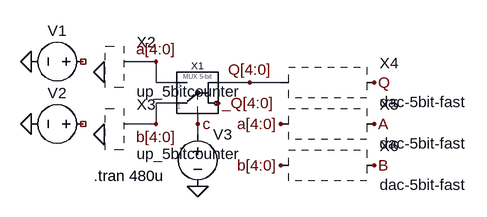
[diagram p0: schematic test-mux-5bit-2to1.asc]
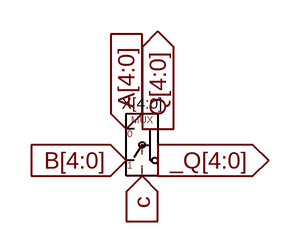
[diagram p1: sub-circuit mux-5bit-2to1.asc]
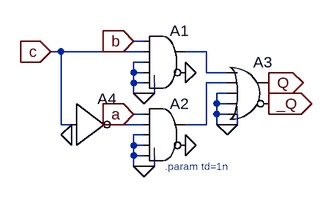
[diagram p2: sub-circuit mux-1bit-2to1.asc]
test-mux-5bit-2to1.asc, the LTspice schematic file:
Version 4
SHEET 1 880 680
WIRE 80 80 32 80
WIRE 80 112 80 80
WIRE 112 112 80 112
WIRE 224 112 176 112
WIRE 272 112 224 112
WIRE 112 144 80 144
WIRE 80 176 80 144
WIRE 80 176 32 176
WIRE 144 176 144 160
WIRE 144 192 144 176
FLAG -112 80 0
FLAG -112 176 0
FLAG 80 80 a[4:0]
FLAG 80 176 b[4:0]
FLAG 144 272 0
FLAG 144 176 c
FLAG 224 112 Q[4:0]
FLAG 176 144 _Q[4:0]
FLAG 0 96 0
FLAG 0 192 0
FLAG 416 112 Q
FLAG 416 176 A
FLAG 416 240 B
FLAG 272 176 a[4:0]
FLAG 272 240 b[4:0]
SYMBOL voltage -16 80 R90
WINDOW 0 -32 56 VBottom 2
WINDOW 3 32 56 Invisible 2
WINDOW 123 0 0 Left 0
WINDOW 39 0 0 Left 0
SYMATTR InstName V1
SYMATTR Value PULSE(0 1 1u 1n 1n 1u 2u)
SYMBOL voltage -16 176 R90
WINDOW 0 -32 56 VBottom 2
WINDOW 3 32 56 Invisible 2
WINDOW 123 0 0 Left 0
WINDOW 39 0 0 Left 0
SYMATTR InstName V2
SYMATTR Value PULSE(0 1 3u 1n 1n 3u 6u)
SYMBOL voltage 144 176 R0
WINDOW 3 24 96 Invisible 2
WINDOW 123 0 0 Left 0
WINDOW 39 0 0 Left 0
SYMATTR Value PULSE(0 1 240u 1n 1n 240u 480u)
SYMATTR InstName V3
SYMBOL dac-5bit-fast 336 112 R0
SYMATTR InstName X4
SYMBOL dac-5bit-fast 336 176 R0
SYMATTR InstName X5
SYMBOL dac-5bit-fast 336 240 R0
SYMATTR InstName X6
SYMBOL mux-5bit-2to1 144 128 R0
SYMATTR InstName X1
SYMBOL up_5bitcounter 0 80 R0
SYMATTR InstName X2
SYMBOL up_5bitcounter 0 176 R0
SYMATTR InstName X3
TEXT -16 256 Left 2 !.tran 480u

mux-5bit-2to1.asc, the sub-circuit schematic file:
Version 4
SHEET 1 880 680
FLAG 160 192 A[4:0]
IOPIN 160 192 In
FLAG 160 224 B[4:0]
IOPIN 160 224 In
FLAG 192 192 Q[4:0]
IOPIN 192 192 Out
FLAG 192 224 _Q[4:0]
IOPIN 192 224 Out
FLAG 176 240 c
IOPIN 176 240 In
SYMBOL mux-1bit-2to1 176 208 R0
SYMATTR InstName X[4:0]

mux-1bit-2to1.asc, the sub-circuit schematic file:
Version 4
SHEET 1 880 680
WIRE 144 64 128 64
WIRE 16 80 0 80
WIRE 144 80 16 80
WIRE 240 80 208 80
WIRE 144 96 128 96
WIRE 128 112 128 96
WIRE 144 112 128 112
WIRE 240 112 240 80
WIRE 272 112 240 112
WIRE 128 128 128 112
WIRE 144 128 128 128
WIRE 272 128 240 128
WIRE 128 144 128 128
WIRE 144 144 128 144
WIRE 160 144 160 128
WIRE 160 144 144 144
WIRE 272 144 256 144
WIRE 256 160 256 144
WIRE 272 160 256 160
WIRE 144 176 128 176
WIRE 256 176 256 160
WIRE 272 176 256 176
WIRE 16 192 16 80
WIRE 32 192 16 192
WIRE 144 192 96 192
WIRE 240 192 240 128
WIRE 240 192 208 192
WIRE 256 192 256 176
WIRE 272 192 256 192
WIRE 288 192 288 176
WIRE 288 192 272 192
WIRE 144 208 128 208
WIRE 128 224 128 208
WIRE 144 224 128 224
WIRE 128 240 128 224
WIRE 144 240 128 240
WIRE 128 256 128 240
WIRE 144 256 128 256
WIRE 160 256 160 240
WIRE 160 256 144 256
FLAG 144 144 0
FLAG 208 112 0
FLAG 128 64 b
IOPIN 128 64 In
FLAG 0 80 c
IOPIN 0 80 In
FLAG 144 256 0
FLAG 208 224 0
FLAG 128 176 a
IOPIN 128 176 In
FLAG 272 192 0
FLAG 336 160 _Q
IOPIN 336 160 Out
FLAG 336 128 Q
IOPIN 336 128 Out
FLAG 32 208 0
SYMBOL Digital\\and 176 32 R0
SYMATTR InstName A1
SYMBOL Digital\\or 304 80 R0
SYMATTR InstName A3
SYMBOL Digital\\inv 32 128 R0
SYMATTR InstName A4
SYMBOL Digital\\and 176 144 R0
SYMATTR InstName A2
TEXT 176 256 Left 1 ;.param td=1n

The netlist it stands for:
* test-mux-5bit-2to1.asc
V1 NC_01 0 PULSE(0 1 1u 1n 1n 1u 2u)
V2 NC_02 0 PULSE(0 1 3u 1n 1n 3u 6u)
V3 c 0 PULSE(0 1 240u 1n 1n 240u 480u)
* X4: dac-5bit-fast (symbol dac-5bit-fast not available, pin order unknown); nets seen at it: Q, Q[4:0]
* X5: dac-5bit-fast (symbol dac-5bit-fast not available, pin order unknown); nets seen at it: A, a[4:0]
* X6: dac-5bit-fast (symbol dac-5bit-fast not available, pin order unknown); nets seen at it: B, b[4:0]
XX1 a[4] a[3] a[2] a[1] a[0] b[4] b[3] b[2] b[1] b[0] c _Q[4] _Q[3] _Q[2] _Q[1] _Q[0] Q[4] Q[3] Q[2] Q[1] Q[0] mux-5bit-2to1
* X2: up_5bitcounter (symbol up_5bitcounter not available, pin order unknown); nets seen at it: 0, a[4:0]
* X3: up_5bitcounter (symbol up_5bitcounter not available, pin order unknown); nets seen at it: 0, b[4:0]

* block symbol definitions
.subckt mux-5bit-2to1 A[4] A[3] A[2] A[1] A[0] B[4] B[3] B[2] B[1] B[0] c _Q[4] _Q[3] _Q[2] _Q[1] _Q[0] Q[4] Q[3] Q[2] Q[1] Q[0]
XX[4:0] A[4:0] B[4:0] c _Q[4:0] Q[4:0] mux-1bit-2to1
.ends mux-5bit-2to1

.subckt mux-1bit-2to1 a b c _Q Q
A1 b c 0 0 0 0 N001 0 AND
A3 N001 N002 0 0 0 _Q Q 0 OR
A4 c 0 0 0 0 N003 0 0 BUF
A2 a N003 0 0 0 0 N002 0 AND
* .param td=1n
.ends mux-1bit-2to1

.tran 480u
.backanno
.end